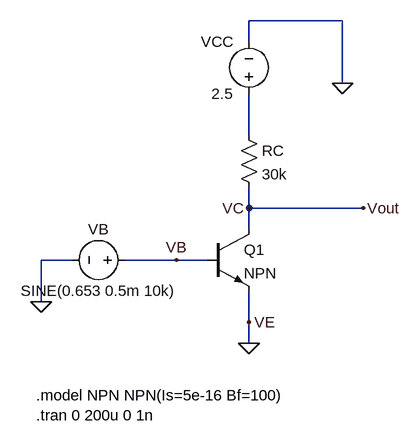
[diagram p0: schematic draft1.asc]
draft1.asc, the LTspice schematic file:
Version 4
SHEET 1 880 680
WIRE 592 -48 448 -48
WIRE 448 -16 448 -48
WIRE 592 48 592 -48
WIRE 448 128 448 64
WIRE 448 240 448 208
WIRE 624 240 448 240
WIRE 448 272 448 240
WIRE 176 320 128 320
WIRE 336 320 256 320
WIRE 384 320 336 320
WIRE 128 384 128 320
WIRE 448 416 448 368
WIRE 448 448 448 416
FLAG 128 384 0
FLAG 592 48 0
FLAG 448 448 0
FLAG 448 240 VC
FLAG 448 416 VE
FLAG 336 320 VB
FLAG 624 240 Vout
SYMBOL npn 384 272 R0
SYMATTR InstName Q1
SYMBOL Res 432 112 R0
SYMATTR InstName RC
SYMATTR Value 30k
SYMBOL Voltage 448 80 R180
WINDOW 0 24 96 Left 2
WINDOW 3 24 16 Left 2
SYMATTR InstName VCC
SYMATTR Value 2.5
SYMBOL Voltage 272 320 R90
WINDOW 0 -32 56 VBottom 2
WINDOW 3 32 56 VTop 2
SYMATTR InstName VB
SYMATTR Value SINE(0.653 0.5m 10k)
TEXT 120 528 Left 2 !.model NPN NPN(Is=5e-16 Bf=100)\n.tran 0 200u 0 1n

The netlist it stands for:
* draft1.asc
Q1 Vout VB 0 0 NPN
RC N001 Vout 30k
VCC N001 0 2.5
VB VB 0 SINE(0.653 0.5m 10k)
.model NPN NPN
.model PNP PNP
.lib standard.bjt
.model NPN NPN(Is=5e-16 Bf=100)
.tran 0 200u 0 1n
.backanno
.end